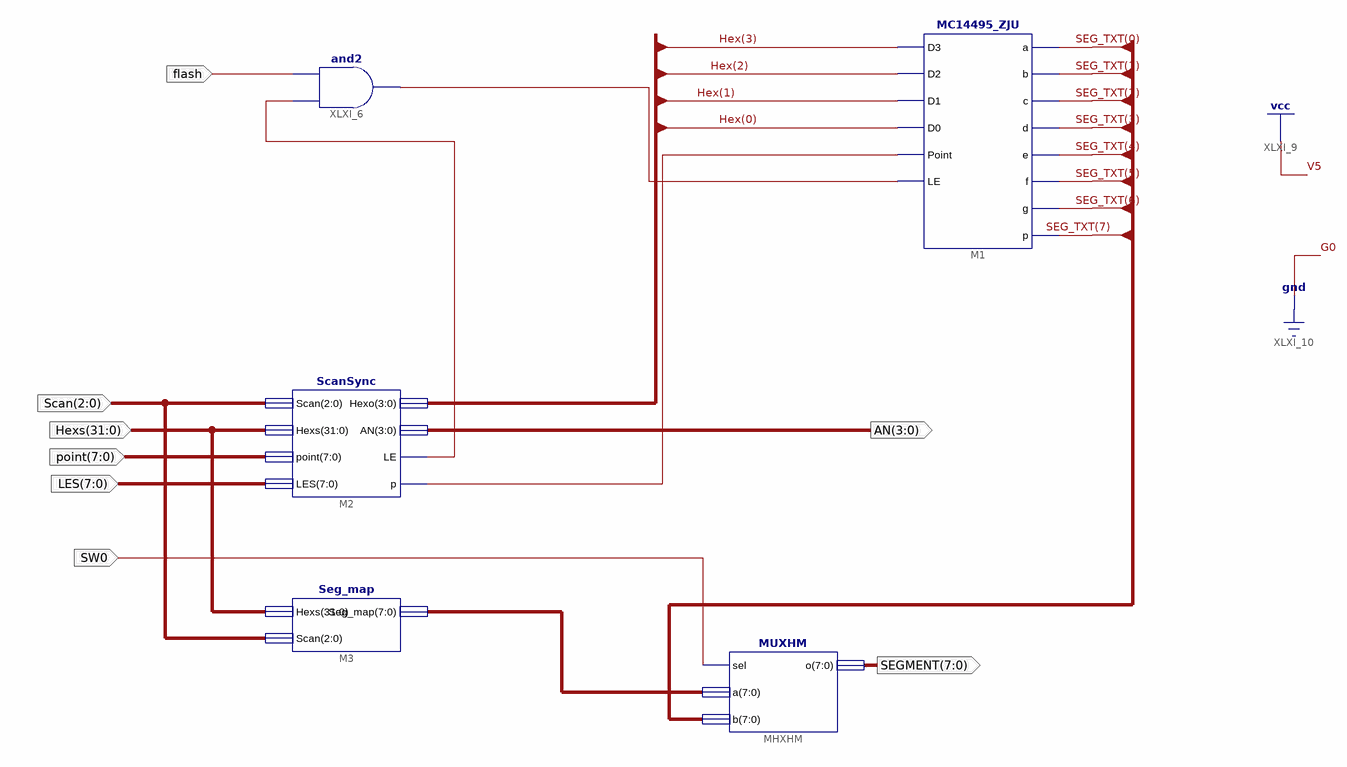
[diagram p0: schematic sheet 1]
// Xilinx ISE schematic Seg7_Dev.sch (kintex7) as structural Verilog: 5 symbols, 8 ports
module Seg7_Dev (
  input  flash,
  input  [2:0] Scan,
  input  [31:0] Hexs,
  input  [7:0] point,
  input  [7:0] LES,
  input  SW0,
  output [3:0] AN,
  output [7:0] SEGMENT
);

  wire XLXN_8, XLXN_9, XLXN_10;
  wire [3:0] Hex;
  wire [7:0] SEG_TXT, XLXN_19;

  ScanSync M2 (.AN(AN), .Hexo(Hex), .Hexs(Hexs), .LE(XLXN_10), .LES(LES), .p(XLXN_9), .point(point), .Scan(Scan));
  MC14495_ZJU M1 (
    .a(SEG_TXT[0]), .b(SEG_TXT[1]), .c(SEG_TXT[2]), .d(SEG_TXT[3]), .D0(Hex[0]), .D1(Hex[1]), .D2(Hex[2]),
    .D3(Hex[3]), .e(SEG_TXT[4]), .f(SEG_TXT[5]), .g(SEG_TXT[6]), .LE(XLXN_8), .p(SEG_TXT[7]), .Point(XLXN_9));
  Seg_map M3 (.Hexs(Hexs), .Scan(Scan), .Seg_map(XLXN_19));
  and XLXI_6 (XLXN_8, XLXN_10, flash);
  MUXHM MHXHM (.sel(SW0), .a(XLXN_19), .b(SEG_TXT), .o(SEGMENT));
endmodule
